# Altium schematic sheet Sheet1.SchDoc
size A
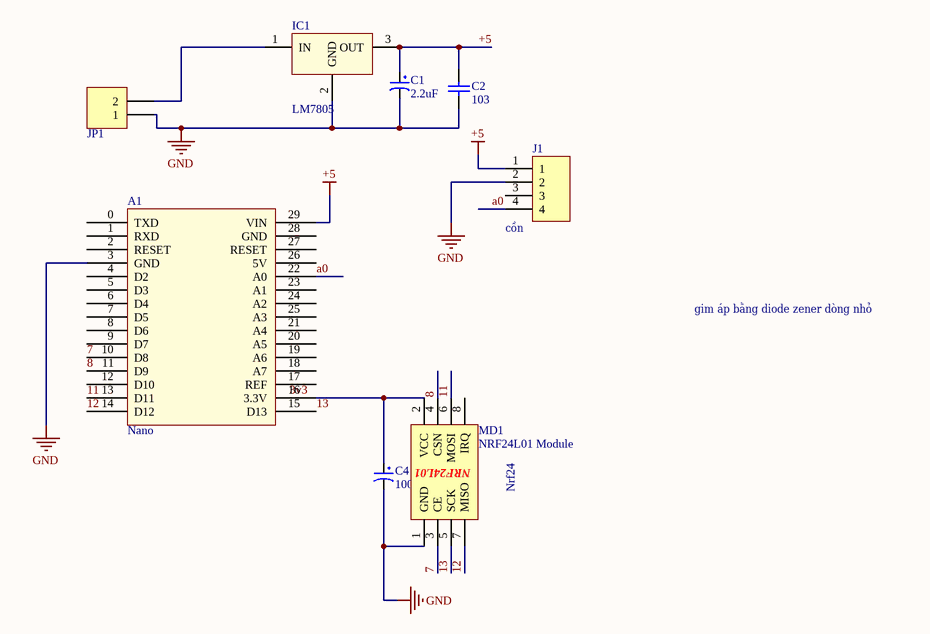
[diagram p0: Sheet1.SchDoc]

## Parts
A1  Nano  [Arduino nano]
C1  2.2uF  [tu hoa 4mm]
C2  103  [tu gom]
C4  100uF  [tu hoa 6.5mm]
IC1  LM7805  [QTO-220]
J1  (no value)  [CON4_50_653004117322_TH_RA]
JP1  Header 2_1  [HED2]  (value not drawn)
MD1  NRF24L01 Module  [NRF24L01]

## Nets
+5: A1.29(VIN) C1.1 C2.1 IC1.3(OUT) J1.1
GND: A1.3(GND) C1.2 C2.2 C4.2 IC1.2(GND) J1.2 JP1.1 MD1.1(GND)
7: A1.10(D8) MD1.3(CE)
8: A1.11(D9) MD1.4(CSN)
11: A1.13(D11) MD1.6(MOSI)
12: A1.14(D12) MD1.7(MISO)
13: A1.15(D13) MD1.5(SCK)
a0: A1.22(A0) J1.4
NetA1_16: A1.16(3.3V) C4.1 MD1.2(VCC)
NetIC1_1: IC1.1(IN) JP1.2

Not connected (* = marked no-connect by the designer): A1 0(TXD) 1(RXD) 2(RESET) 4(D2) 5(D3) 6(D4) 7(D5) 8(D6) 9(D7) 12(D10) 17(REF) 18(A7) 19(A6) 20(A5) 21(A4) 23(A1) 24(A2) 25(A3) 26(5V) 27(RESET) 28(GND); J1 3; MD1 8(IRQ)

## Notes on the sheet
- (near J1) cồn
- gim áp bằng diode zener dòng nhỏ
- (near MD1) Nrf24
- Labels drawn without touching a wire or pin: 3v3
- (in symbol NRF24L01 Module) NRF24L01

## Library data of the parts
A1 = Arduino Nano
C1 = Tu Hoa 2.2uF 50V 4x7: Cắm; Ten_Linh_Kien: Tụ Hóa 2.2uF 50V 4x7MM; Don_Vi: Con; So_Chan: 2; Ma_Hang: MH001356; Chung_Loai: Cắm; Kieu_Chan: *
C2 = Tu gom 103 50V: Cắm; So_Chan: 2; Ten_Linh_Kien: Tụ gốm 103 10nF 50V; Don_Vi: Con; Ma_Hang: MH000936; Chung_Loai: Cắm; Kieu_Chan: *
C4 = Tu Hoa 100uF 35V 6x8: Cắm; Don_Vi: Con; So_Chan: 2; Ten_Linh_Kien: Tụ Hóa 100uF 35V; Ma_Hang: MH006862; Chung_Loai: Cắm; Kieu_Chan: *
IC1 = LM78xx: On ap +, from + 5 to + 24VDC; Value: LM7805
J1 = CON-PLG_4X1-50-RA-TH: 4 Pins, 1 Row 1.25mm Pitch, right angle Connector, male; Manufacturer Part Number: 653004117322; Manufacturer: JST; Mating Part Number: 653004113322; Crimp Part Number: 653153128130; Alternate Part Number-1: NA; Case/Package: TH-CON; Supplier-1: WURTH; Supplier Part Number-1: 653004117322
JP1 = Header 2_1: Header, 2-Pin; Manufacturer: Generic Components; Class: Connector; Value: Header 2